# EAGLE schematic Constant current (EAGLE 6.2)
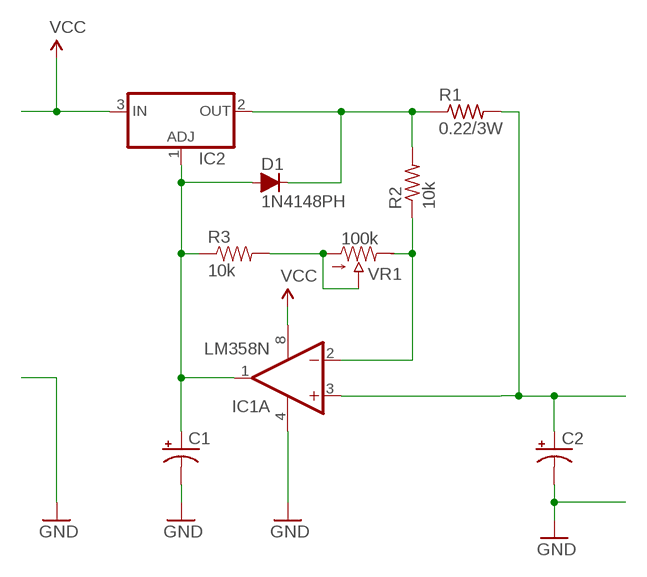
[diagram p0: schematic, sheet 1]

## Parts
C1  CAP_POLPTH1  [CPOL-RADIAL-100UF-25V]
C2  CAP_POLPTH1  [CPOL-RADIAL-100UF-25V]
D1  1N4148PH  [DO35-7]
IC1  LM358N  [DIL08]
IC2  LM338T  [TO220V-REG]
R1  0.22/3W  R-US_0414/15  [0414/15]
R2  10k  R-US_0414/15  [0414/15]
R3  10k  RESISTORKIT  [AXIAL-0.3-KIT]
VR1  100k  POT100K_3362U  [3362U]

## Nets
GND: C1.2(-) C2.2(-) IC1.4(P:V-)
N$1: D1.C IC2.2(OUT) R1.1 R2.2
N$2: C1.1(+) D1.A IC1.1(A:OUT) IC2.1(ADJ) R3.P$1
N$3: IC1.2(A:-IN) R2.1 VR1.P$1(E)
N$4: R3.P$2 VR1.P$2(S) VR1.P$3(A)
N$6: C2.1(+) IC1.3(A:+IN) R1.2
VCC: IC1.8(P:V+) IC2.3(IN)
Unconnected: IC1.5(B:+IN) IC1.6(B:-IN) IC1.7(B:OUT)

## Library data of the parts
C1 C2 = SparkFun:CAP_POL: Capacitor Polarized These are standard SMD and PTH capacitors. Normally 10uF, 47uF, and 100uF in electrolytic and tantalum varieties. Always verify the external diameter of the through hole cap, it varies with capacity, voltage, and manufacturer. The EIA devices should be standard.
D1 = JPN:1N4148: DIODE high speed (Philips)
IC1 = linear:LM358: OP AMP also LM158; LM258; LM2904 Source: http://cache.national.com/ds/LM/LM158.pdf
IC2 = My Library:LM338T: VOLTAGE REGULATOR
R1 R2 = rcl:R-US_: RESISTOR, American symbol
R3 = SparkFun:RESISTOR: Resistor Basic schematic elements and footprints for 0603, 1206, and PTH resistors.
VR1 = My Library:POT